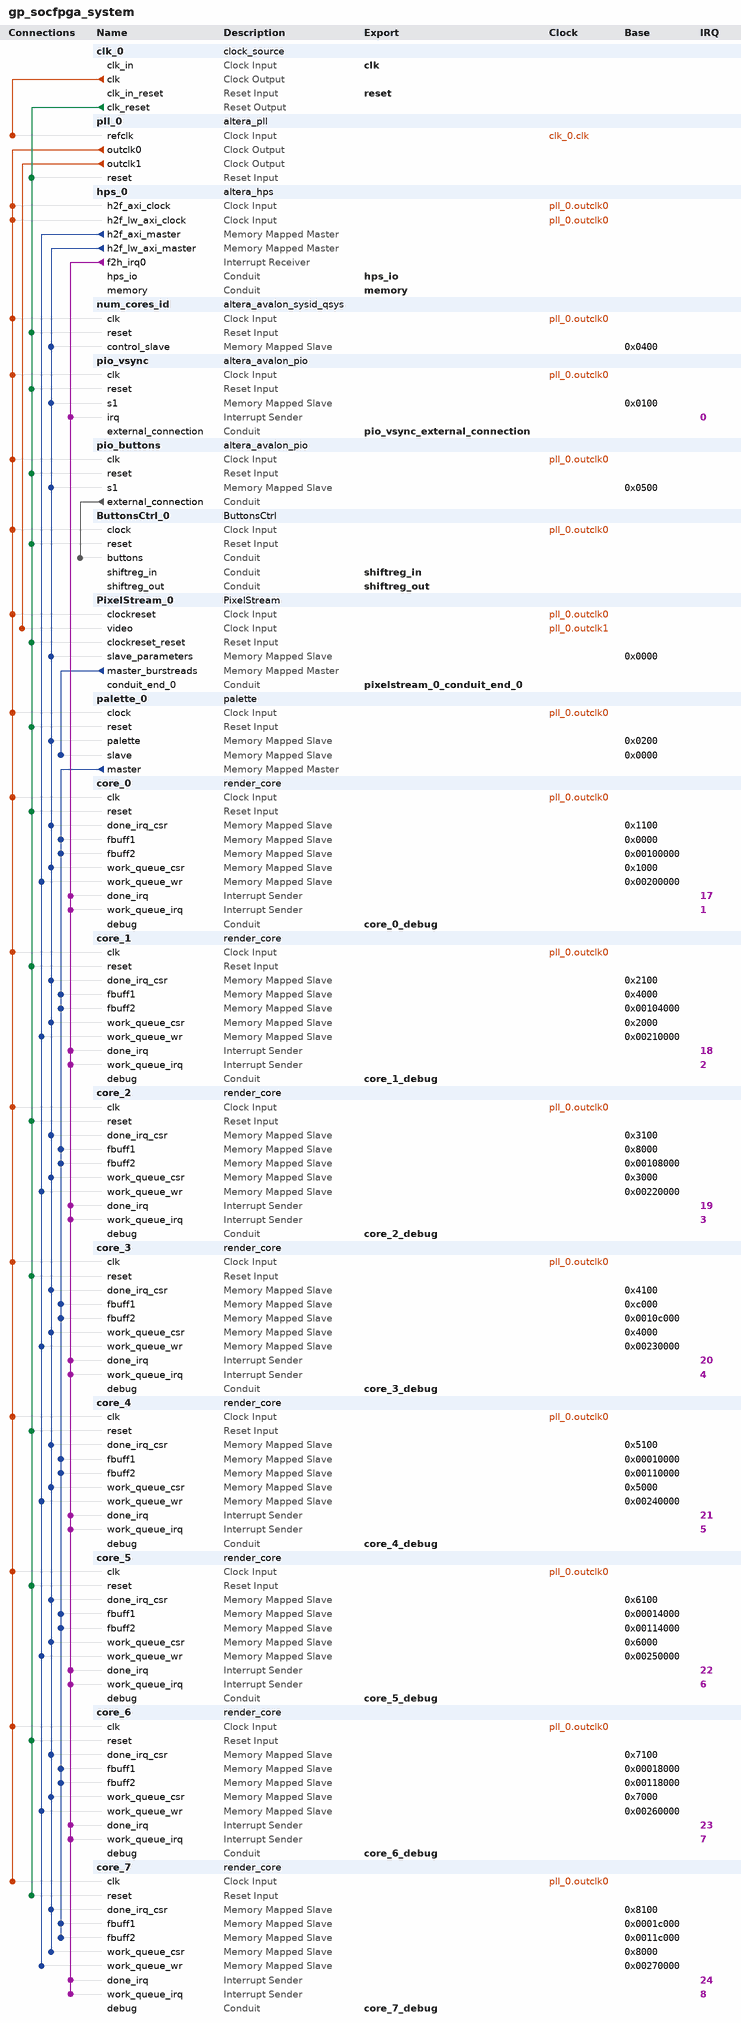
[diagram p0: system contents]
# Platform Designer (Qsys) system gp_socfpga_system, Cyclone V 5CSEMA5F31C6
# Parameters at their usual value, and those the tool derives, are not listed.
package require -exact qsys 16.0
create_system gp_socfpga_system
set_project_property DEVICE_FAMILY {Cyclone V}
set_project_property DEVICE 5CSEMA5F31C6

add_instance clk_0 clock_source 16.0
set_instance_parameter_value clk_0 clockFrequency 50000000

add_instance pll_0 altera_pll 16.0
set_instance_parameter_value pll_0 gui_actual_output_clock_frequency0 {96.000000 MHz}
set_instance_parameter_value pll_0 gui_device_speed_grade 2
set_instance_parameter_value pll_0 gui_number_of_clocks 2
set_instance_parameter_value pll_0 gui_operation_mode direct
set_instance_parameter_value pll_0 gui_output_clock_frequency0 96.0
set_instance_parameter_value pll_0 gui_output_clock_frequency1 9.0
set_instance_parameter_value pll_0 gui_pll_mode {Integer-N PLL}
set_instance_parameter_value pll_0 gui_reference_clock_frequency 50.0
set_instance_parameter_value pll_0 gui_use_locked false

add_instance hps_0 altera_hps 16.0
set_instance_parameter_value hps_0 EMAC1_Mode RGMII
set_instance_parameter_value hps_0 EMAC1_PinMuxing {HPS I/O Set 0}
set_instance_parameter_value hps_0 F2SCLK_COLDRST_Enable false
set_instance_parameter_value hps_0 F2SCLK_DBGRST_Enable false
set_instance_parameter_value hps_0 F2SCLK_WARMRST_Enable false
set_instance_parameter_value hps_0 F2SINTERRUPT_Enable true
set_instance_parameter_value hps_0 F2S_Width 0
set_instance_parameter_value hps_0 FPGA_PERIPHERAL_OUTPUT_CLOCK_FREQ_EMAC0_GTX_CLK 125
set_instance_parameter_value hps_0 FPGA_PERIPHERAL_OUTPUT_CLOCK_FREQ_EMAC0_MD_CLK 2.5
set_instance_parameter_value hps_0 FPGA_PERIPHERAL_OUTPUT_CLOCK_FREQ_EMAC1_GTX_CLK 125
set_instance_parameter_value hps_0 FPGA_PERIPHERAL_OUTPUT_CLOCK_FREQ_EMAC1_MD_CLK 2.5
set_instance_parameter_value hps_0 HPS_PROTOCOL DDR3
set_instance_parameter_value hps_0 I2C0_Mode I2C
set_instance_parameter_value hps_0 I2C0_PinMuxing {HPS I/O Set 0}
set_instance_parameter_value hps_0 I2C1_Mode I2C
set_instance_parameter_value hps_0 I2C1_PinMuxing {HPS I/O Set 0}
set_instance_parameter_value hps_0 LWH2F_Enable true
set_instance_parameter_value hps_0 MEM_BANKADDR_WIDTH 3
set_instance_parameter_value hps_0 MEM_CLK_FREQ 400.0
set_instance_parameter_value hps_0 MEM_COL_ADDR_WIDTH 10
set_instance_parameter_value hps_0 MEM_DQ_WIDTH 32
set_instance_parameter_value hps_0 MEM_DRV_STR RZQ/7
set_instance_parameter_value hps_0 MEM_ROW_ADDR_WIDTH 15
set_instance_parameter_value hps_0 MEM_RTT_NOM RZQ/4
set_instance_parameter_value hps_0 MEM_RTT_WR RZQ/4
set_instance_parameter_value hps_0 MEM_TCL 11
set_instance_parameter_value hps_0 MEM_TFAW_NS 30.0
set_instance_parameter_value hps_0 MEM_TRAS_NS 35.0
set_instance_parameter_value hps_0 MEM_TRCD_NS 13.75
set_instance_parameter_value hps_0 MEM_TRFC_NS 260.0
set_instance_parameter_value hps_0 MEM_TRP_NS 13.75
set_instance_parameter_value hps_0 MEM_VENDOR JEDEC
set_instance_parameter_value hps_0 MEM_WTCL 8
set_instance_parameter_value hps_0 QSPI_Mode {1 SS}
set_instance_parameter_value hps_0 QSPI_PinMuxing {HPS I/O Set 0}
set_instance_parameter_value hps_0 REF_CLK_FREQ 25.0
set_instance_parameter_value hps_0 S2FCLK_USER2CLK 5
set_instance_parameter_value hps_0 S2F_Width 2
set_instance_parameter_value hps_0 SDIO_Mode {4-bit Data}
set_instance_parameter_value hps_0 SDIO_PinMuxing {HPS I/O Set 0}
set_instance_parameter_value hps_0 SPIM1_Mode {Single Slave Select}
set_instance_parameter_value hps_0 SPIM1_PinMuxing {HPS I/O Set 0}
set_instance_parameter_value hps_0 STM_Enable false
set_instance_parameter_value hps_0 TIMING_BOARD_AC_SKEW 0.03
set_instance_parameter_value hps_0 TIMING_BOARD_AC_TO_CK_SKEW 0.0
set_instance_parameter_value hps_0 TIMING_BOARD_DQ_TO_DQS_SKEW 0.0
set_instance_parameter_value hps_0 TIMING_BOARD_MAX_CK_DELAY 0.03
set_instance_parameter_value hps_0 TIMING_BOARD_MAX_DQS_DELAY 0.02
set_instance_parameter_value hps_0 TIMING_BOARD_SKEW_BETWEEN_DQS 0.08
set_instance_parameter_value hps_0 TIMING_BOARD_SKEW_CKDQS_DIMM_MAX 0.16
set_instance_parameter_value hps_0 TIMING_BOARD_SKEW_CKDQS_DIMM_MIN 0.09
set_instance_parameter_value hps_0 TIMING_BOARD_SKEW_WITHIN_DQS 0.01
set_instance_parameter_value hps_0 TIMING_TDH 65
set_instance_parameter_value hps_0 TIMING_TDQSCK 255
set_instance_parameter_value hps_0 TIMING_TDQSQ 125
set_instance_parameter_value hps_0 TIMING_TDS 30
set_instance_parameter_value hps_0 TIMING_TIH 140
set_instance_parameter_value hps_0 TIMING_TIS 180
set_instance_parameter_value hps_0 TIMING_TQSH 0.4
set_instance_parameter_value hps_0 UART0_Mode {No Flow Control}
set_instance_parameter_value hps_0 UART0_PinMuxing {HPS I/O Set 0}
set_instance_parameter_value hps_0 USB1_Mode SDR
set_instance_parameter_value hps_0 USB1_PinMuxing {HPS I/O Set 0}
set_instance_parameter_value hps_0 desired_cfg_clk_mhz 100.0
set_instance_parameter_value hps_0 desired_qspi_clk_mhz 400.0

add_instance num_cores_id altera_avalon_sysid_qsys 16.0
set_instance_parameter_value num_cores_id id 8

add_instance pio_vsync altera_avalon_pio 16.0
set_instance_parameter_value pio_vsync captureEdge true
set_instance_parameter_value pio_vsync direction Input
set_instance_parameter_value pio_vsync edgeType FALLING
set_instance_parameter_value pio_vsync generateIRQ true
set_instance_parameter_value pio_vsync irqType EDGE
set_instance_parameter_value pio_vsync width 1

add_instance pio_buttons altera_avalon_pio 16.0
set_instance_parameter_value pio_buttons direction Input
set_instance_parameter_value pio_buttons width 16

add_instance ButtonsCtrl_0 ButtonsCtrl 1.0

add_instance PixelStream_0 PixelStream 1.0

add_instance palette_0 palette 1.0
set_instance_parameter_value palette_0 NUM_CORES 8

add_instance core_0 render_core 1.0
set_instance_parameter_value core_0 core_id 0
set_instance_parameter_value core_0 num_cores 8

add_instance core_1 render_core 1.0
set_instance_parameter_value core_1 core_id 1
set_instance_parameter_value core_1 num_cores 8

add_instance core_2 render_core 1.0
set_instance_parameter_value core_2 core_id 2
set_instance_parameter_value core_2 num_cores 8

add_instance core_3 render_core 1.0
set_instance_parameter_value core_3 core_id 3
set_instance_parameter_value core_3 num_cores 8

add_instance core_4 render_core 1.0
set_instance_parameter_value core_4 core_id 4
set_instance_parameter_value core_4 num_cores 8

add_instance core_5 render_core 1.0
set_instance_parameter_value core_5 core_id 5
set_instance_parameter_value core_5 num_cores 8

add_instance core_6 render_core 1.0
set_instance_parameter_value core_6 core_id 6
set_instance_parameter_value core_6 num_cores 8

add_instance core_7 render_core 1.0
set_instance_parameter_value core_7 core_id 7
set_instance_parameter_value core_7 num_cores 8

# connections
add_connection clk_0.clk pll_0.refclk clock
add_connection pll_0.outclk0 ButtonsCtrl_0.clock clock
add_connection pll_0.outclk0 core_0.clk clock
add_connection pll_0.outclk0 core_1.clk clock
add_connection pll_0.outclk0 core_2.clk clock
add_connection pll_0.outclk0 core_3.clk clock
add_connection pll_0.outclk0 core_4.clk clock
add_connection pll_0.outclk0 core_5.clk clock
add_connection pll_0.outclk0 core_6.clk clock
add_connection pll_0.outclk0 core_7.clk clock
add_connection pll_0.outclk0 hps_0.h2f_axi_clock clock
add_connection pll_0.outclk0 hps_0.h2f_lw_axi_clock clock
add_connection pll_0.outclk0 num_cores_id.clk clock
add_connection pll_0.outclk0 palette_0.clock clock
add_connection pll_0.outclk0 pio_buttons.clk clock
add_connection pll_0.outclk0 pio_vsync.clk clock
add_connection pll_0.outclk0 PixelStream_0.clockreset clock
add_connection pll_0.outclk1 PixelStream_0.video clock
add_connection clk_0.clk_reset ButtonsCtrl_0.reset reset
add_connection clk_0.clk_reset core_0.reset reset
add_connection clk_0.clk_reset core_1.reset reset
add_connection clk_0.clk_reset core_2.reset reset
add_connection clk_0.clk_reset core_3.reset reset
add_connection clk_0.clk_reset core_4.reset reset
add_connection clk_0.clk_reset core_5.reset reset
add_connection clk_0.clk_reset core_6.reset reset
add_connection clk_0.clk_reset core_7.reset reset
add_connection clk_0.clk_reset num_cores_id.reset reset
add_connection clk_0.clk_reset palette_0.reset reset
add_connection clk_0.clk_reset pio_buttons.reset reset
add_connection clk_0.clk_reset pio_vsync.reset reset
add_connection clk_0.clk_reset PixelStream_0.clockreset_reset reset
add_connection clk_0.clk_reset pll_0.reset reset
add_connection hps_0.h2f_axi_master core_0.work_queue_wr avalon
set_connection_parameter_value hps_0.h2f_axi_master/core_0.work_queue_wr baseAddress 0x00200000
add_connection hps_0.h2f_axi_master core_1.work_queue_wr avalon
set_connection_parameter_value hps_0.h2f_axi_master/core_1.work_queue_wr baseAddress 0x00210000
add_connection hps_0.h2f_axi_master core_2.work_queue_wr avalon
set_connection_parameter_value hps_0.h2f_axi_master/core_2.work_queue_wr baseAddress 0x00220000
add_connection hps_0.h2f_axi_master core_3.work_queue_wr avalon
set_connection_parameter_value hps_0.h2f_axi_master/core_3.work_queue_wr baseAddress 0x00230000
add_connection hps_0.h2f_axi_master core_4.work_queue_wr avalon
set_connection_parameter_value hps_0.h2f_axi_master/core_4.work_queue_wr baseAddress 0x00240000
add_connection hps_0.h2f_axi_master core_5.work_queue_wr avalon
set_connection_parameter_value hps_0.h2f_axi_master/core_5.work_queue_wr baseAddress 0x00250000
add_connection hps_0.h2f_axi_master core_6.work_queue_wr avalon
set_connection_parameter_value hps_0.h2f_axi_master/core_6.work_queue_wr baseAddress 0x00260000
add_connection hps_0.h2f_axi_master core_7.work_queue_wr avalon
set_connection_parameter_value hps_0.h2f_axi_master/core_7.work_queue_wr baseAddress 0x00270000
add_connection hps_0.h2f_lw_axi_master core_0.done_irq_csr avalon
set_connection_parameter_value hps_0.h2f_lw_axi_master/core_0.done_irq_csr baseAddress 0x1100
add_connection hps_0.h2f_lw_axi_master core_0.work_queue_csr avalon
set_connection_parameter_value hps_0.h2f_lw_axi_master/core_0.work_queue_csr baseAddress 0x1000
add_connection hps_0.h2f_lw_axi_master core_1.done_irq_csr avalon
set_connection_parameter_value hps_0.h2f_lw_axi_master/core_1.done_irq_csr baseAddress 0x2100
add_connection hps_0.h2f_lw_axi_master core_1.work_queue_csr avalon
set_connection_parameter_value hps_0.h2f_lw_axi_master/core_1.work_queue_csr baseAddress 0x2000
add_connection hps_0.h2f_lw_axi_master core_2.done_irq_csr avalon
set_connection_parameter_value hps_0.h2f_lw_axi_master/core_2.done_irq_csr baseAddress 0x3100
add_connection hps_0.h2f_lw_axi_master core_2.work_queue_csr avalon
set_connection_parameter_value hps_0.h2f_lw_axi_master/core_2.work_queue_csr baseAddress 0x3000
add_connection hps_0.h2f_lw_axi_master core_3.done_irq_csr avalon
set_connection_parameter_value hps_0.h2f_lw_axi_master/core_3.done_irq_csr baseAddress 0x4100
add_connection hps_0.h2f_lw_axi_master core_3.work_queue_csr avalon
set_connection_parameter_value hps_0.h2f_lw_axi_master/core_3.work_queue_csr baseAddress 0x4000
add_connection hps_0.h2f_lw_axi_master core_4.done_irq_csr avalon
set_connection_parameter_value hps_0.h2f_lw_axi_master/core_4.done_irq_csr baseAddress 0x5100
add_connection hps_0.h2f_lw_axi_master core_4.work_queue_csr avalon
set_connection_parameter_value hps_0.h2f_lw_axi_master/core_4.work_queue_csr baseAddress 0x5000
add_connection hps_0.h2f_lw_axi_master core_5.done_irq_csr avalon
set_connection_parameter_value hps_0.h2f_lw_axi_master/core_5.done_irq_csr baseAddress 0x6100
add_connection hps_0.h2f_lw_axi_master core_5.work_queue_csr avalon
set_connection_parameter_value hps_0.h2f_lw_axi_master/core_5.work_queue_csr baseAddress 0x6000
add_connection hps_0.h2f_lw_axi_master core_6.done_irq_csr avalon
set_connection_parameter_value hps_0.h2f_lw_axi_master/core_6.done_irq_csr baseAddress 0x7100
add_connection hps_0.h2f_lw_axi_master core_6.work_queue_csr avalon
set_connection_parameter_value hps_0.h2f_lw_axi_master/core_6.work_queue_csr baseAddress 0x7000
add_connection hps_0.h2f_lw_axi_master core_7.done_irq_csr avalon
set_connection_parameter_value hps_0.h2f_lw_axi_master/core_7.done_irq_csr baseAddress 0x8100
add_connection hps_0.h2f_lw_axi_master core_7.work_queue_csr avalon
set_connection_parameter_value hps_0.h2f_lw_axi_master/core_7.work_queue_csr baseAddress 0x8000
add_connection hps_0.h2f_lw_axi_master num_cores_id.control_slave avalon
set_connection_parameter_value hps_0.h2f_lw_axi_master/num_cores_id.control_slave baseAddress 0x0400
add_connection hps_0.h2f_lw_axi_master palette_0.palette avalon
set_connection_parameter_value hps_0.h2f_lw_axi_master/palette_0.palette baseAddress 0x0200
add_connection hps_0.h2f_lw_axi_master pio_buttons.s1 avalon
set_connection_parameter_value hps_0.h2f_lw_axi_master/pio_buttons.s1 baseAddress 0x0500
add_connection hps_0.h2f_lw_axi_master pio_vsync.s1 avalon
set_connection_parameter_value hps_0.h2f_lw_axi_master/pio_vsync.s1 baseAddress 0x0100
add_connection hps_0.h2f_lw_axi_master PixelStream_0.slave_parameters avalon
set_connection_parameter_value hps_0.h2f_lw_axi_master/PixelStream_0.slave_parameters baseAddress 0x0000
add_connection palette_0.master core_0.fbuff1 avalon
set_connection_parameter_value palette_0.master/core_0.fbuff1 baseAddress 0x0000
add_connection palette_0.master core_0.fbuff2 avalon
set_connection_parameter_value palette_0.master/core_0.fbuff2 baseAddress 0x00100000
add_connection palette_0.master core_1.fbuff1 avalon
set_connection_parameter_value palette_0.master/core_1.fbuff1 baseAddress 0x4000
add_connection palette_0.master core_1.fbuff2 avalon
set_connection_parameter_value palette_0.master/core_1.fbuff2 baseAddress 0x00104000
add_connection palette_0.master core_2.fbuff1 avalon
set_connection_parameter_value palette_0.master/core_2.fbuff1 baseAddress 0x8000
add_connection palette_0.master core_2.fbuff2 avalon
set_connection_parameter_value palette_0.master/core_2.fbuff2 baseAddress 0x00108000
add_connection palette_0.master core_3.fbuff1 avalon
set_connection_parameter_value palette_0.master/core_3.fbuff1 baseAddress 0xc000
add_connection palette_0.master core_3.fbuff2 avalon
set_connection_parameter_value palette_0.master/core_3.fbuff2 baseAddress 0x0010c000
add_connection palette_0.master core_4.fbuff1 avalon
set_connection_parameter_value palette_0.master/core_4.fbuff1 baseAddress 0x00010000
add_connection palette_0.master core_4.fbuff2 avalon
set_connection_parameter_value palette_0.master/core_4.fbuff2 baseAddress 0x00110000
add_connection palette_0.master core_5.fbuff1 avalon
set_connection_parameter_value palette_0.master/core_5.fbuff1 baseAddress 0x00014000
add_connection palette_0.master core_5.fbuff2 avalon
set_connection_parameter_value palette_0.master/core_5.fbuff2 baseAddress 0x00114000
add_connection palette_0.master core_6.fbuff1 avalon
set_connection_parameter_value palette_0.master/core_6.fbuff1 baseAddress 0x00018000
add_connection palette_0.master core_6.fbuff2 avalon
set_connection_parameter_value palette_0.master/core_6.fbuff2 baseAddress 0x00118000
add_connection palette_0.master core_7.fbuff1 avalon
set_connection_parameter_value palette_0.master/core_7.fbuff1 baseAddress 0x0001c000
add_connection palette_0.master core_7.fbuff2 avalon
set_connection_parameter_value palette_0.master/core_7.fbuff2 baseAddress 0x0011c000
add_connection PixelStream_0.master_burstreads palette_0.slave avalon
set_connection_parameter_value PixelStream_0.master_burstreads/palette_0.slave baseAddress 0x0000
add_connection pio_buttons.external_connection ButtonsCtrl_0.buttons conduit
add_connection hps_0.f2h_irq0 core_0.done_irq interrupt
set_connection_parameter_value hps_0.f2h_irq0/core_0.done_irq irqNumber 17
add_connection hps_0.f2h_irq0 core_0.work_queue_irq interrupt
set_connection_parameter_value hps_0.f2h_irq0/core_0.work_queue_irq irqNumber 1
add_connection hps_0.f2h_irq0 core_1.done_irq interrupt
set_connection_parameter_value hps_0.f2h_irq0/core_1.done_irq irqNumber 18
add_connection hps_0.f2h_irq0 core_1.work_queue_irq interrupt
set_connection_parameter_value hps_0.f2h_irq0/core_1.work_queue_irq irqNumber 2
add_connection hps_0.f2h_irq0 core_2.done_irq interrupt
set_connection_parameter_value hps_0.f2h_irq0/core_2.done_irq irqNumber 19
add_connection hps_0.f2h_irq0 core_2.work_queue_irq interrupt
set_connection_parameter_value hps_0.f2h_irq0/core_2.work_queue_irq irqNumber 3
add_connection hps_0.f2h_irq0 core_3.done_irq interrupt
set_connection_parameter_value hps_0.f2h_irq0/core_3.done_irq irqNumber 20
add_connection hps_0.f2h_irq0 core_3.work_queue_irq interrupt
set_connection_parameter_value hps_0.f2h_irq0/core_3.work_queue_irq irqNumber 4
add_connection hps_0.f2h_irq0 core_4.done_irq interrupt
set_connection_parameter_value hps_0.f2h_irq0/core_4.done_irq irqNumber 21
add_connection hps_0.f2h_irq0 core_4.work_queue_irq interrupt
set_connection_parameter_value hps_0.f2h_irq0/core_4.work_queue_irq irqNumber 5
add_connection hps_0.f2h_irq0 core_5.done_irq interrupt
set_connection_parameter_value hps_0.f2h_irq0/core_5.done_irq irqNumber 22
add_connection hps_0.f2h_irq0 core_5.work_queue_irq interrupt
set_connection_parameter_value hps_0.f2h_irq0/core_5.work_queue_irq irqNumber 6
add_connection hps_0.f2h_irq0 core_6.done_irq interrupt
set_connection_parameter_value hps_0.f2h_irq0/core_6.done_irq irqNumber 23
add_connection hps_0.f2h_irq0 core_6.work_queue_irq interrupt
set_connection_parameter_value hps_0.f2h_irq0/core_6.work_queue_irq irqNumber 7
add_connection hps_0.f2h_irq0 core_7.done_irq interrupt
set_connection_parameter_value hps_0.f2h_irq0/core_7.done_irq irqNumber 24
add_connection hps_0.f2h_irq0 core_7.work_queue_irq interrupt
set_connection_parameter_value hps_0.f2h_irq0/core_7.work_queue_irq irqNumber 8
add_connection hps_0.f2h_irq0 pio_vsync.irq interrupt
set_connection_parameter_value hps_0.f2h_irq0/pio_vsync.irq irqNumber 0

# exported interfaces
add_interface clk clock sink
set_interface_property clk EXPORT_OF clk_0.clk_in
add_interface core_0_debug conduit end
set_interface_property core_0_debug EXPORT_OF core_0.debug
add_interface core_1_debug conduit end
set_interface_property core_1_debug EXPORT_OF core_1.debug
add_interface core_2_debug conduit end
set_interface_property core_2_debug EXPORT_OF core_2.debug
add_interface core_3_debug conduit end
set_interface_property core_3_debug EXPORT_OF core_3.debug
add_interface core_4_debug conduit end
set_interface_property core_4_debug EXPORT_OF core_4.debug
add_interface core_5_debug conduit end
set_interface_property core_5_debug EXPORT_OF core_5.debug
add_interface core_6_debug conduit end
set_interface_property core_6_debug EXPORT_OF core_6.debug
add_interface core_7_debug conduit end
set_interface_property core_7_debug EXPORT_OF core_7.debug
add_interface hps_io conduit end
set_interface_property hps_io EXPORT_OF hps_0.hps_io
add_interface memory conduit end
set_interface_property memory EXPORT_OF hps_0.memory
add_interface pio_vsync_external_connection conduit end
set_interface_property pio_vsync_external_connection EXPORT_OF pio_vsync.external_connection
add_interface pixelstream_0_conduit_end_0 conduit end
set_interface_property pixelstream_0_conduit_end_0 EXPORT_OF PixelStream_0.conduit_end_0
add_interface reset reset sink
set_interface_property reset EXPORT_OF clk_0.clk_in_reset
add_interface shiftreg_in conduit end
set_interface_property shiftreg_in EXPORT_OF ButtonsCtrl_0.shiftreg_in
add_interface shiftreg_out conduit end
set_interface_property shiftreg_out EXPORT_OF ButtonsCtrl_0.shiftreg_out

set_interconnect_requirement {$system} qsys_mm.clockCrossingAdapter HANDSHAKE
set_interconnect_requirement {$system} qsys_mm.enableEccProtection FALSE
set_interconnect_requirement {$system} qsys_mm.insertDefaultSlave FALSE
set_interconnect_requirement {$system} qsys_mm.maxAdditionalLatency 1

save_system gp_socfpga_system.qsys
